# EAGLE schematic SparkFun_Artemis_Global_Tracker (EAGLE 9.6.2)

## Sheet 1 of 2
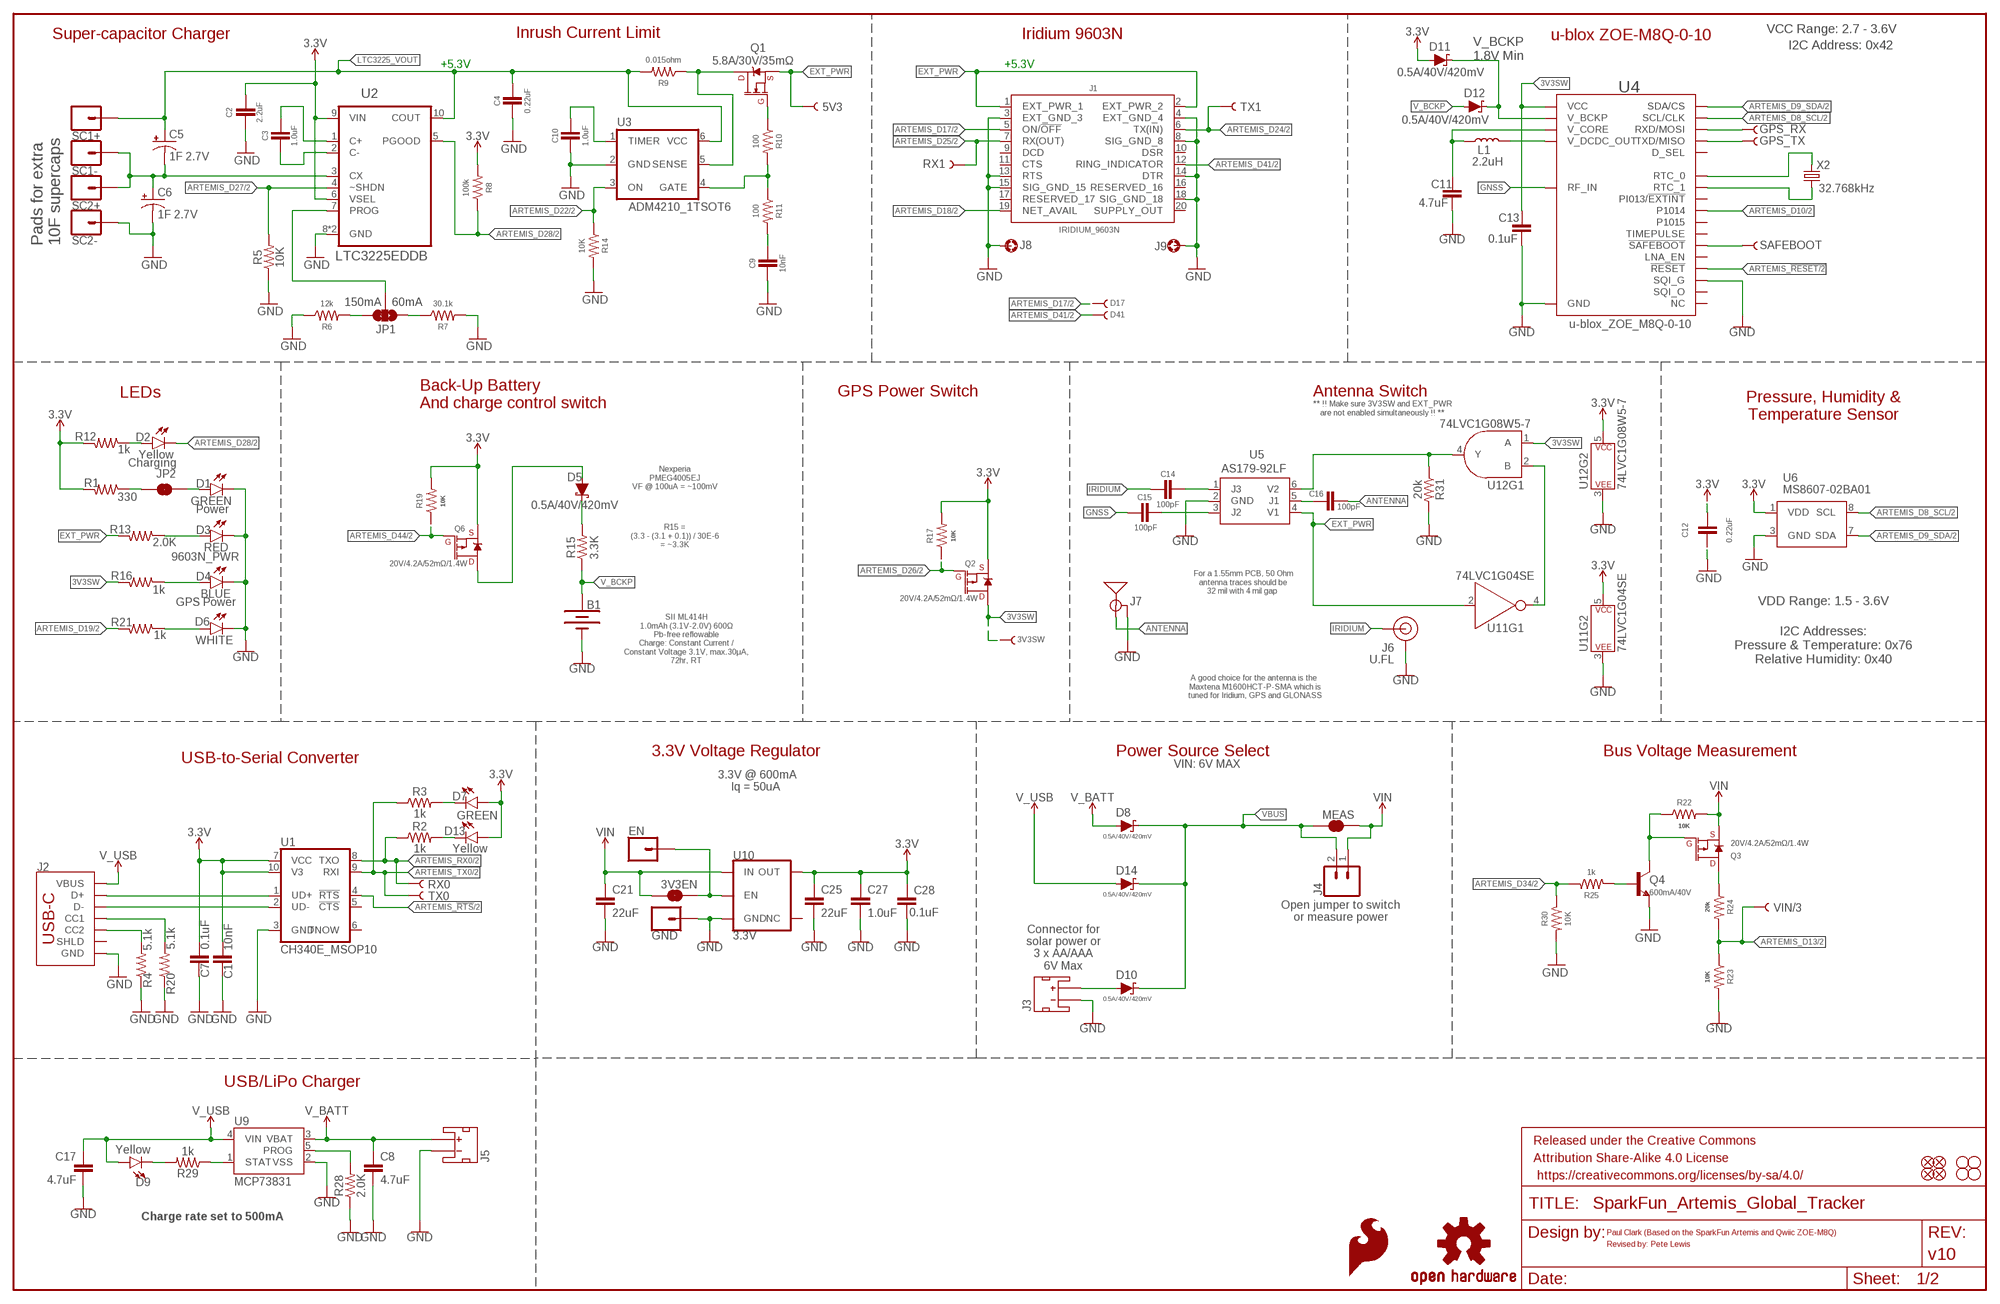
[diagram p0: schematic, sheet 1]

### Parts
3V3EN  JUMPER-SMT_2_NC_TRACE_SILK  [SMT-JUMPER_2_NC_TRACE_SILK]
3V3SW  TEST-POINT3X5  [PAD.03X.05]
5V3  TEST-POINT3X5  [PAD.03X.05]
B1  ML414H_IV01E_BATTERY  [ML414H_IV01E]
C1  10nF  10NF-0603-50V-10%  [0603]
C2  2.2uF  2.2UF-0603-10V-20%  [0603]
C3  1.0uF  1.0UF-0603-16V-10%-X7R  [0603]
C4  0.22uF  0.22UF-0603-25V-10%  [0603]
C5  1F 2.7V  1F-2.7V(PTH)CPOL-RADIAL-1H-2.7V  [CPOL-RADIAL-1F-2.7V]
C6  1F 2.7V  1F-2.7V(PTH)CPOL-RADIAL-1H-2.7V  [CPOL-RADIAL-1F-2.7V]
C7  0.1uF  0.1UF-0603-25V-5%  [0603]
C8  4.7uF  4.7UF-0603-6.3V-(10%)  [0603]
C9  10nF  10NF-0603-50V-10%  [0603]
C10  1.0uF  1.0UF-0603-16V-10%-X7R  [0603]
C11  4.7uF  4.7UF-0603-6.3V-(10%)  [0603]
C12  0.22uF  0.22UF-0603-25V-10%  [0603]
C13  0.1uF  0.1UF-0603-25V-5%  [0603]
C14  100pF  100PF-0603-50V-5%  [0603]
C15  100pF  100PF-0603-50V-5%  [0603]
C16  100pF  100PF-0603-50V-5%  [0603]
C17  4.7uF  4.7UF-0603-6.3V-(10%)  [0603]
C21  22uF  22UF-0805-16V-20%  [0805]
C25  22uF  22UF-0805-16V-20%  [0805]
C27  1.0uF  1.0UF-0603-16V-10%-X7R  [0603]
C28  0.1uF  0.1UF-0603-25V-5%  [0603]
D1  GREEN  LED-GREEN0603  [LED-0603]
D2  Yellow  LED-YELLOW0603  [LED-0603]
D3  RED  LED-RED0603  [LED-0603]
D4  BLUE  LED-BLUE0603  [LED-0603]
D5  0.5A/40V/420mV  DIODE-SCHOTTKY-PMEG4005EJ  [SOD-323]
D6  WHITE  LED-WHITE0603  [LED-0603]
D7  GREEN  LED-GREEN0603  [LED-0603]
D8  0.5A/40V/420mV  DIODE-SCHOTTKY-PMEG4005EJ  [SOD-323]
D9  Yellow  LED-YELLOW0603  [LED-0603]
D10  0.5A/40V/420mV  DIODE-SCHOTTKY-PMEG4005EJ  [SOD-323]
D11  0.5A/40V/420mV  DIODE-SCHOTTKY-PMEG4005EJ  [SOD-323]
D12  0.5A/40V/420mV  DIODE-SCHOTTKY-PMEG4005EJ  [SOD-323]
D13  Yellow  LED-YELLOW0603  [LED-0603]
D14  0.5A/40V/420mV  DIODE-SCHOTTKY-PMEG4005EJ  [SOD-323]
D17  TEST-POINT3X5  [PAD.03X.05]
D41  TEST-POINT3X5  [PAD.03X.05]
EN  CONN_01PTH_NO_SILK_YES_STOP  [1X01_NO_SILK]
FRAME5  FRAME-LEDGER  [CREATIVE_COMMONS]
GND  CONN_01PTH_NO_SILK_YES_STOP  [1X01_NO_SILK]
GPS_RX  TEST-POINT3X5  [PAD.03X.05]
GPS_TX  TEST-POINT3X5  [PAD.03X.05]
J1  IRIDIUM_9603N  [IRIDIUM_9603N]
J2  USB-C  USB_C_2-LAYER_PADS  [USB-C-16P-2LAYER-PADS]
J3  JST_2MM_MALE  [JST-2-SMD]
J4  CONN_021X02_NO_SILK  [1X02_NO_SILK]
J5  JST_2MM_MALE  [JST-2-SMD]
J6  U.FL  U.FL2PIN  [U.FL]
J7  ANTENNA-GROUNDEDEDGE_SMA  [SMA-EDGE]
J8  STAND-OFF-REFLOW-M2.0_6.0MM_TALL  [STAND-OFF-REFLOW-M2.0]
J9  STAND-OFF-REFLOW-M2.0_6.0MM_TALL  [STAND-OFF-REFLOW-M2.0]
JP1  JUMPER-SMT_3_1-NC_TRACE_SILK  [SMT-JUMPER_3_1-NC_TRACE_SILK]
JP2  JUMPER-SMT_2_NC_TRACE_SILK  [SMT-JUMPER_2_NC_TRACE_SILK]
JP7  FIDUCIAL1X2  [FIDUCIAL-1X2]
JP8  FIDUCIAL1X2  [FIDUCIAL-1X2]
JP9  STAND-OFF  [STAND-OFF]
JP10  STAND-OFF  [STAND-OFF]
JP11  STAND-OFF  [STAND-OFF]
JP12  STAND-OFF  [STAND-OFF]
JP13  FIDUCIAL1X2  [FIDUCIAL-1X2]
JP14  FIDUCIAL1X2  [FIDUCIAL-1X2]
L1  2.2uH  2.2μH_SHIELDED_INDUCTOR  [0806]
LOGO2  SFE_LOGO_FLAME.3_INCH  [SFE_LOGO_FLAME_.3]
LOGO4  OSHW-LOGOMINI  [OSHW-LOGO-MINI]
MEAS  JUMPER-SMT_2_NC_TRACE_SILK  [SMT-JUMPER_2_NC_TRACE_SILK]
Q1  5.8A/30V/35mΩ  MOSFET-NCH-AO3404A  [SOT23-3]
Q2  20V/4.2A/52mΩ/1.4W  MOSFET_PCH-DMG2305UX-7  [SOT23-3]
Q3  20V/4.2A/52mΩ/1.4W  MOSFET_PCH-DMG2305UX-7  [SOT23-3]
Q4  600mA/40V  TRANS_NPN-MMBT2222AL  [SOT23-3]
Q6  20V/4.2A/52mΩ/1.4W  MOSFET_PCH-DMG2305UX-7  [SOT23-3]
R1  330  330OHM-0402T-1/16W-5%  [0402-TIGHT]
R2  1k  1KOHM-0402T-1/16W-1%  [0402-TIGHT]
R3  1k  1KOHM-0402T-1/16W-1%  [0402-TIGHT]
R4  5.1k  5.1KOHM-0402T-1/16W-1%  [0402-TIGHT]
R5  10K  10KOHM-0402-1/10W-0.1%  [0402-TIGHT]
R6  12k  12KOHM-0603-1/10W-1%  [0603]
R7  30.1k  30.1KOHM-0603-1/10W-1%  [0603]
R8  100k  100KOHM-0603-1/10W-1%  [0603]
R9  0.015ohm  0.015OHM_1%_1/3W_0603  [0603]
R10  100  100OHM-0402-TIGHT-1/16W-1%  [0402-TIGHT]
R11  100  100OHM-0402-TIGHT-1/16W-1%  [0402-TIGHT]
R12  1k  1KOHM-0402T-1/16W-1%  [0402-TIGHT]
R13  2.0K  2.0KOHM-0402T-1/16W-1%  [0402-TIGHT]
R14  10K  10KOHM-0402-1/10W-0.1%  [0402-TIGHT]
R15  3.3K  3.3KOHM-0402T-1/16W-1%  [0402-TIGHT]
R16  1k  1KOHM-0402T-1/16W-1%  [0402-TIGHT]
R17  10K  10KOHM-0402-1/10W-0.1%  [0402-TIGHT]
R19  10K  10KOHM-0402-1/10W-0.1%  [0402-TIGHT]
R20  5.1k  5.1KOHM-0402T-1/16W-1%  [0402-TIGHT]
R21  1k  1KOHM-0402T-1/16W-1%  [0402-TIGHT]
R22  10K  10KOHM-0402-1/10W-0.1%  [0402-TIGHT]
R23  10K  10KOHM-0402-1/10W-0.1%  [0402-TIGHT]
R24  20k  20KOHM-0603-1/10W-1%  [0603]
R25  1k  1KOHM-0402T-1/16W-1%  [0402-TIGHT]
R28  2.0K  2.0KOHM-0402T-1/16W-1%  [0402-TIGHT]
R29  1k  1KOHM-0402T-1/16W-1%  [0402-TIGHT]
R30  10K  10KOHM-0402-1/10W-0.1%  [0402-TIGHT]
R31  20k  20KOHM-0402T-1/16W-1%  [0402-TIGHT]
RX0  TEST-POINT3X5  [PAD.03X.05]
RX1  TEST-POINT3X5  [PAD.03X.05]
SAFEBOOT  TEST-POINT3X5  [PAD.03X.05]
SC1+  CONN_01PTH_NO_SILK_YES_STOP  [1X01_NO_SILK]
SC1-  CONN_01PTH_NO_SILK_YES_STOP  [1X01_NO_SILK]
SC2+  CONN_01PTH_NO_SILK_YES_STOP  [1X01_NO_SILK]
SC2-  CONN_01PTH_NO_SILK_YES_STOP  [1X01_NO_SILK]
TX0  TEST-POINT3X5  [PAD.03X.05]
TX1  TEST-POINT3X5  [PAD.03X.05]
U1  CH340E_MSOP10  [MSOP10]
U2  LTC3225EDDB  LTC3225EDDBDFN300X200-10L  [DFN300X200-10L]
U3  ADM4210_1TSOT6  [TSOT6]
U4  u-blox_ZOE_M8Q-0-10  U-BLOX_ZOE_M8Q-0-10  [UBLOX_ZOE_M8-0-10]
U5  AS179-92LF  [SOT65P220X100-6N]
U6  MS8607-02BA01  [MS8607-02BA01]
U9  MCP73831  [SOT23-5]
U10  3.3V  V_REG_AP2112K-3.3V  [SOT23-5]
U11  74LVC1G04SE  [SOT353]
U12  74LVC1G08W5-7  74LVC08_W5-7  [SOT23-5]
VIN/3  TEST-POINT3X5  [PAD.03X.05]
X2  32.768kHz  CRYSTAL-32.768KHZSMD-3.2X1.5  [CRYSTAL-SMD-3.2X1.5MM]

### Nets
3.3V [3.3V]: C1.1 C2.1 C7.1 C12.1 C25.1 C27.1 C28.1 D7.A D11.A D13.A Q2.2(S) Q6.2(S) R1.2 R8.2 R12.2 R17.2 R19.2 U1.7(VCC) U1.10(V3) U2.6(VSEL) U2.9(VIN) U6.1(VDD) U10.5(OUT) U11.5(P$V+) U12.5(P$V+) ; also sheet 2
3V3SW: 3V3SW.1 C13.1 Q2.3(D) R16.2 U4.24(VCC) U4.25(VCC) U12.1(A)
ANTENNA: C16.1 J7.SIG(SIGNAL)
ARTEMIS_!RESET: U4.20(!RESET) ; also sheet 2
ARTEMIS_!RTS!: U1.4(!RTS) ; also sheet 2
ARTEMIS_D8_SCL: U4.32(SCL/CLK) U6.8(SCL) ; also sheet 2
ARTEMIS_D9_SDA: U4.2(SDA/CS) U6.7(SDA) ; also sheet 2
ARTEMIS_D10: U4.50(P1014) ; also sheet 2
ARTEMIS_D13: R23.1 R24.2 VIN/3.1 ; also sheet 2
ARTEMIS_D17: D17.1 J1.5(ON/!OFF!) ; also sheet 2
ARTEMIS_D18: J1.19(NET_AVAIL) ; also sheet 2
ARTEMIS_D19: R21.2 ; also sheet 2
ARTEMIS_D22: R14.1 U3.3(ON) ; also sheet 2
ARTEMIS_D24: J1.6(TX(IN)) TX1.1 ; also sheet 2
ARTEMIS_D25: J1.7(RX(OUT)) RX1.1 ; also sheet 2
ARTEMIS_D26: Q2.1(G) R17.1 ; also sheet 2
ARTEMIS_D27: R5.2 U2.4(~SHDN) ; also sheet 2
ARTEMIS_D28: D2.C R8.1 U2.5(PGOOD) ; also sheet 2
ARTEMIS_D34: R25.1 R30.1 ; also sheet 2
ARTEMIS_D41: D41.1 J1.12(RING_INDICATOR) ; also sheet 2
ARTEMIS_D44: Q6.1(G) R19.1 ; also sheet 2
ARTEMIS_RX0: R2.1 RX0.1 U1.8(TXO) ; also sheet 2
ARTEMIS_TX0: R3.1 TX0.1 U1.9(RXI) ; also sheet 2
CC3: J2.B5(CC2) R4.2
CC4: J2.A5(CC1) R20.2
D+2: J2.A6(D+) J2.B6(D+) U1.1(UD+)
D-2: J2.A7(D-) J2.B7(D-) U1.2(UD-)
EXT_PWR: 5V3.1 J1.1(EXT_PWR_1) J1.2(EXT_PWR_2) Q1.2(S) R13.2 U5.4(V1) U11.2(A)
GND: B1.- C1.2 C2.2 C4.2 C6.- C7.2 C8.2 C9.2 C10.2 C11.2 C12.2 C13.2 C17.2 C21.2 C25.2 C27.2 C28.2 D1.C D3.C D4.C D6.C GND.1 J1.3(EXT_GND_3) J1.4(EXT_GND_4) J1.8(SIG_GND_8) J1.13(RTS) J1.14(DTR) J1.15(SIG_GND_15) J1.18(SIG_GND_18) J2.GND J2.GND2(GND) J3.1(-) J5.1(-) J6.1(GND) J6.2(GND) J7.GND@0(GND) J7.GND@1(GND) J7.GND@2(GND) J7.GND@3(GND) J8.1 J9.1 Q4.2(E) R4.1 R5.1 R6.1 R7.2 R14.2 R20.1 R23.2 R28.1 R30.2 R31.2 SC2-.1 U1.3(GND) U2.8(GND) U2.11(GND) U3.2(GND) U4.1(GND) U4.3(GND) U4.5(GND) U4.7(GND) U4.8(GND) U4.9(GND) U4.10(GND) U4.11(GND) U4.12(GND) U4.17(GND) U4.23(GND) U4.29(SQI_G) U4.31(SQI_G) U4.37(GND) U4.38(GND) U4.39(GND) U4.40(GND) U4.41(GND) U4.44(GND) U4.46(SQI_G) U4.47(SQI_G) U4.49(GND) U5.2(GND) U6.3(GND) U9.2(VSS) U10.2(GND) U11.3(P$V-) U12.3(P$V-) ; also sheet 2
GNSS: C15.2 U4.4(RF_IN)
IRIDIUM: C14.2 J6.FEED(SIGNAL)
LTC3225_VOUT: C4.1 C5.+ R9.2 SC1+.1 U2.10(COUT) U3.6(VCC)
N$1: C5.- C6.+ SC1-.1 SC2+.1 U2.3(CX)
N$2: JP1.3 R6.2
N$3: JP2.2 R1.1
N$4: JP1.1 R7.1
N$5: D2.A R12.1
N$6: D3.A R13.1
N$7: D5.A Q6.3(D)
N$8: Q1.3(D) R9.1 U3.5(SENSE)
N$9: C3.2 U2.2(C-)
N$10: C3.1 U2.1(C+)
N$11: JP1.2 U2.7(PROG)
N$12: Q1.1(G) R10.1
N$13: R10.2 R11.1 U3.4(GATE)
N$14: C9.1 R11.2
N$15: C10.1 U3.1(TIMER)
N$16: L1.2 U4.26(V_DCDC_OUT)
N$17: C11.1 L1.1 U4.27(V_CORE)
N$18: U4.18(RTC_0) X2.P$2
N$19: U4.19(RTC_1) X2.P$1
N$20: D5.C R15.2
N$21: D4.A R16.1
N$22: D13.C R2.2
N$23: D1.A JP2.1
N$24: D11.C D12.C U4.16(V_BCKP)
N$25: SAFEBOOT.1 U4.34(!SAFEBOOT)
N$26: GPS_RX.1 U4.22(RXD/MOSI)
N$27: GPS_TX.1 U4.21(TXD/MISO)
N$28: C14.1 U5.1(J3)
N$29: C15.1 U5.3(J2)
N$30: C16.2 U5.5(J1)
N$31: R31.1 U5.6(V2) U12.4(Y)
N$32: D7.C R3.2
N$33: U11.4(Y) U12.2(B)
N$35: D6.A R21.1
N$36: 3V3EN.2 EN.1 U10.3(EN)
N$37: Q3.1(G) Q4.3(C) R22.1
N$39: R28.2 U9.5(PROG)
N$40: D9.C R29.2
N$41: R29.1 U9.1(STAT)
N$46: Q3.3(D) R24.1
N$47: Q4.1(B) R25.2
V_AAA: D10.A J3.2(+)
V_BATT: C8.1 D8.A J5.2(+) U9.3(VBAT)
V_BCKP: B1.+ D12.A R15.1
V_USB: C17.1 D9.A D14.A J2.VBUS1(VBUS) J2.VBUS2(VBUS) U9.4(VIN)
VBUS: D8.C D10.C D14.C J4.2 MEAS.1
VIN: 3V3EN.1 C21.1 J4.1 MEAS.2 Q3.2(S) R22.2 U10.1(IN)
Unconnected: J1.9(DCD) J1.10(DSR) J1.11(CTS) J1.16(RESERVED_16) J1.17(RESERVED_17) J1.20(SUPPLY_OUT) J2.SHLD1(SHLD) J2.SHLD2(SHLD) J2.SHLD3(SHLD) J2.SHLD4(SHLD) J3.NC1(PAD1) J3.NC2(PAD2) J5.NC1(PAD1) J5.NC2(PAD2) U1.5(!CTS) U1.6(TNOW) U4.6(NC) U4.13(NC) U4.14(NC) U4.15(NC) U4.28(NC) U4.30(SQI_O) U4.33(TIMEPULSE) U4.35(LNA_EN) U4.36(P1015) U4.42(NC) U4.43(PI013/!EXTINT) U4.45(SQI_O) U4.48(D_SEL) U4.51(NC) U10.4(NC)

### Notes on the sheet
- VCC Range: 2.7 - 3.6V
- Super-capacitor Charger | Inrush Current Limit | Iridium 9603N | u-blox ZOE-M8Q-0-10
- I2C Address: 0x42
- V_BCKP
  1.8V Min
- +5.3V | +5.3V
- Pads for extra
  10F supercaps
- 150mA | 60mA
- LEDs | GPS Power Switch | Antenna Switch
- Back-Up Battery
  And charge control switch
- ** !! Make sure 3V3SW and EXT_PWR
  are not enabled simultaneously !! **
- Pressure, Humidity &
  Temperature Sensor
- Charging
- Nexperia
  PMEG4005EJ
  VF @ 100uA = ~100mV
- Power
- R15 =
  (3.3 - (3.1 + 0.1)) / 30E-6
  = ~3.3K
- 9603N_PWR
- For a 1.55mm PCB, 50 Ohm
  antenna traces should be
  32 mil with 4 mil gap
- GPS Power | VDD Range: 1.5 - 3.6V
- SII ML414H
  1.0mAh (3.1V-2.0V) 600Ω
  Pb-free reflowable
  Charge: Constant Current /
  Constant Voltage 3.1V, max.30μA,
  72hr, RT
- I2C Addresses:
  Pressure & Temperature: 0x76
  Relative Humidity: 0x40
- A good choice for the antenna is the 
  Maxtena M1600HCT-P-SMA which is
  tuned for Iridium, GPS and GLONASS
- USB-to-Serial Converter | 3.3V Voltage Regulator | Power Source Select | Bus Voltage Measurement
- VIN: 6V MAX
- 3.3V @ 600mA
  Iq = 50uA
- Open jumper to switch
  or measure power
- Connector for
  solar power or
  3 x AA/AAA
  6V Max
- USB/LiPo Charger
- Charge rate set to 500mA
- Paul Clark (Based on the SparkFun Artemis and Qwiic ZOE-M8Q)
- Revised by: Pete Lewis

## Sheet 2 of 2
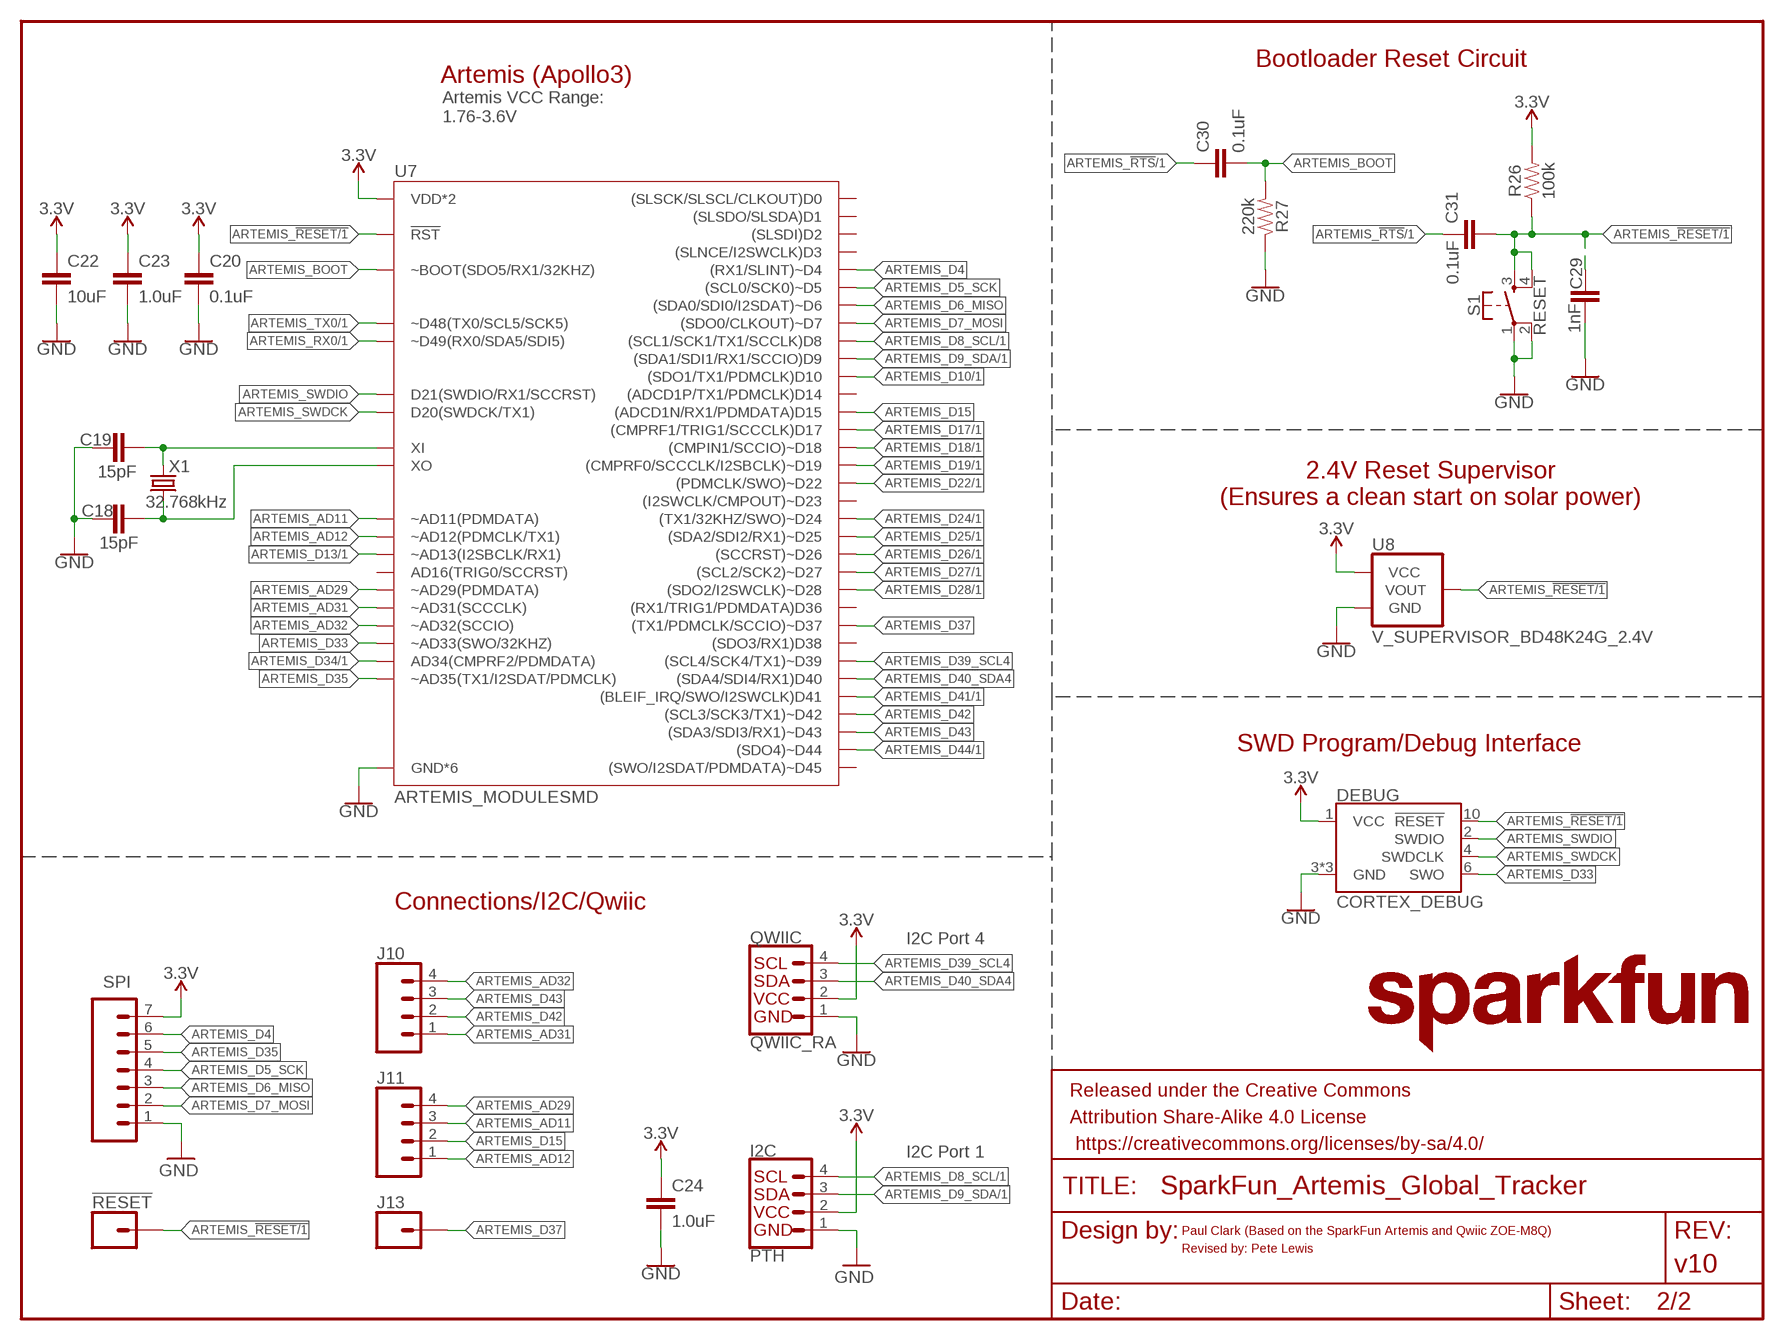
[diagram p1: schematic, sheet 2]

### Parts
!RESET  CONN_01PTH_NO_SILK_YES_STOP  [1X01_NO_SILK]
C18  15pF  15PF-0603-50V-5%  [0603]
C19  15pF  15PF-0603-50V-5%  [0603]
C20  0.1uF  0.1UF-0603-25V-5%  [0603]
C22  10uF  10UF-0603-6.3V-20%  [0603]
C23  1.0uF  1.0UF-0603-16V-10%-X7R  [0603]
C24  1.0uF  1.0UF-0603-16V-10%-X7R  [0603]
C29  1nF  1.0NF/1000PF-0603-50V-10%  [0603]
C30  0.1uF  0.1UF-0603-25V-5%  [0603]
C31  0.1uF  0.1UF-0603-25V-5%  [0603]
DEBUG  CORTEX_DEBUG  CORTEX_JTAG_DEBUG_MINIMUM_PTH_NS  [2X5-PTH-1.27MM-NO_SILK]
FRAME3  FRAME-LETTERNO_PACKAGE  [DUMMY]
I2C  PTH  I2C_STANDARD_NO_SILK  [1X04_NO_SILK]
J10  CONN_041X04_NO_SILK_NO_POP  [1X04_NO_SILK]
J11  CONN_041X04_NO_SILK_NO_POP  [1X04_NO_SILK]
J13  CONN_01PTH_NO_SILK_YES_STOP  [1X01_NO_SILK]
LOGO1  SFE_LOGO_NAME.1_INCH  [SFE_LOGO_NAME_.1]
QWIIC  QWIIC_RA  QWIIC_CONNECTORJS-1MM  [JST04_1MM_RA]
R26  100k  100KOHM-0603-1/10W-1%  [0603]
R27  220k  220KOHM-0603-1/10W-1%  [0603]
S1  RESET  MOMENTARY-SWITCH-SPST-2-SMD-5.2MM-TALL  [TACTILE_SWITCH_SMD_5.2MM]
SPI  CONN_07NO_SILK  [1X07_NO_SILK]
U7  ARTEMIS_MODULESMD  [ARTEMIS_FP]
U8  V_SUPERVISOR_BD48K24G_2.4V  [SOT23-3]
X1  32.768kHz  CRYSTAL-32.768KHZSMD-3.2X1.5  [CRYSTAL-SMD-3.2X1.5MM]

### Nets
3.3V [3.3V]: C20.2 C22.1 C23.1 C24.1 DEBUG.1(VCC) I2C.2 QWIIC.2 R26.2 SPI.7 U7.VDD@36(VDD*2) U7.VDD@37(VDD*2) U8.3(VCC) ; also sheet 1
ARTEMIS_!RESET: !RESET.1 C29.1 C31.2 DEBUG.10(!RESET) R26.1 S1.3 S1.4 U7.~RST(!RST) U8.2(VOUT) ; also sheet 1
ARTEMIS_!RTS!: C30.1 C31.1 ; also sheet 1
ARTEMIS_AD11: J11.3 U7.~AD11(~AD11(PDMDATA))
ARTEMIS_AD12: J11.1 U7.~AD12(~AD12(PDMCLK/TX1))
ARTEMIS_AD29: J11.4 U7.~AD29(~AD29(PDMDATA))
ARTEMIS_AD31: J10.1 U7.~AD31(~AD31(SCCCLK))
ARTEMIS_AD32: J10.4 U7.~AD32(~AD32(SCCIO))
ARTEMIS_BOOT: C30.2 R27.2 U7.BOOT(~BOOT(SDO5/RX1/32KHZ))
ARTEMIS_D4: SPI.6 U7.~D4((RX1/SLINT)~D4)
ARTEMIS_D5_SCK: SPI.4 U7.~D5((SCL0/SCK0)~D5)
ARTEMIS_D6_MISO: SPI.3 U7.~D6((SDA0/SDI0/I2SDAT)~D6)
ARTEMIS_D7_MOSI: SPI.2 U7.D7((SDO0/CLKOUT)~D7)
ARTEMIS_D8_SCL: I2C.4 U7.D8((SCL1/SCK1/TX1/SCCLK)D8) ; also sheet 1
ARTEMIS_D9_SDA: I2C.3 U7.D9((SDA1/SDI1/RX1/SCCIO)D9) ; also sheet 1
ARTEMIS_D10: U7.D10((SDO1/TX1/PDMCLK)D10) ; also sheet 1
ARTEMIS_D13: U7.~AD13(~AD13(I2SBCLK/RX1)) ; also sheet 1
ARTEMIS_D15: J11.2 U7.D15((ADCD1N/RX1/PDMDATA)D15)
ARTEMIS_D17: U7.D17((CMPRF1/TRIG1/SCCCLK)D17) ; also sheet 1
ARTEMIS_D18: U7.~D18((CMPIN1/SCCIO)~D18) ; also sheet 1
ARTEMIS_D19: U7.~D19((CMPRF0/SCCCLK/I2SBCLK)~D19) ; also sheet 1
ARTEMIS_D22: U7.~D22((PDMCLK/SWO)~D22) ; also sheet 1
ARTEMIS_D24: U7.~D24((TX1/32KHZ/SWO)~D24) ; also sheet 1
ARTEMIS_D25: U7.~D25((SDA2/SDI2/RX1)~D25) ; also sheet 1
ARTEMIS_D26: U7.~D26((SCCRST)~D26) ; also sheet 1
ARTEMIS_D27: U7.~D27((SCL2/SCK2)~D27) ; also sheet 1
ARTEMIS_D28: U7.~D28((SDO2/I2SWCLK)~D28) ; also sheet 1
ARTEMIS_D33: DEBUG.6(SWO) U7.~AD33/SWO(~AD33(SWO/32KHZ))
ARTEMIS_D34: U7.AD34(AD34(CMPRF2/PDMDATA)) ; also sheet 1
ARTEMIS_D35: SPI.5 U7.~AD35(~AD35(TX1/I2SDAT/PDMCLK))
ARTEMIS_D37: J13.1 U7.~D37((TX1/PDMCLK/SCCIO)~D37)
ARTEMIS_D39_SCL4: QWIIC.4 U7.~D39((SCL4/SCK4/TX1)~D39)
ARTEMIS_D40_SDA4: QWIIC.3 U7.D40((SDA4/SDI4/RX1)D40)
ARTEMIS_D41: U7.D41((BLEIF_IRQ/SWO/I2SWCLK)D41) ; also sheet 1
ARTEMIS_D42: J10.2 U7.~D42((SCL3/SCK3/TX1)~D42)
ARTEMIS_D43: J10.3 U7.~D43((SDA3/SDI3/RX1)~D43)
ARTEMIS_D44: U7.~D44((SDO4)~D44) ; also sheet 1
ARTEMIS_RX0: U7.RXI-0(~D49(RX0/SDA5/SDI5)) ; also sheet 1
ARTEMIS_SWDCK: DEBUG.4(SWDCLK) U7.SWDCK(D20(SWDCK/TX1))
ARTEMIS_SWDIO: DEBUG.2(SWDIO) U7.SWDIO(D21(SWDIO/RX1/SCCRST))
ARTEMIS_TX0: U7.TXO-0(~D48(TX0/SCL5/SCK5)) ; also sheet 1
GND: C18.1 C19.1 C20.1 C22.2 C23.2 C24.2 C29.2 DEBUG.3(GND) DEBUG.5(GND) DEBUG.9(GND) I2C.1 QWIIC.1 R27.1 S1.1 S1.2 SPI.1 U7.GND@1(GND*6) U7.GND@22(GND*6) U7.GND@38(GND*6) U7.GND@39(GND*6) U7.GND@47(GND*6) U7.GND@59(GND*6) U8.1(GND) ; also sheet 1
XTALI: C19.2 U7.XI X1.P$1
XTALO: C18.2 U7.XO X1.P$2
Unconnected: U7.AD16(AD16(TRIG0/SCCRST)) U7.D0((SLSCK/SLSCL/CLKOUT)D0) U7.D1((SLSDO/SLSDA)D1) U7.D2((SLSDI)D2) U7.D3((SLNCE/I2SWCLK)D3) U7.D14((ADCD1P/TX1/PDMCLK)D14) U7.D36((RX1/TRIG1/PDMDATA)D36) U7.D38((SDO3/RX1)D38) U7.~D23((I2SWCLK/CMPOUT)~D23) U7.~D45((SWO/I2SDAT/PDMDATA)~D45)

### Notes on the sheet
- Bootloader Reset Circuit
- Artemis (Apollo3)
- Artemis VCC Range:
  1.76-3.6V
- 2.4V Reset Supervisor
  (Ensures a clean start on solar power)
- SWD Program/Debug Interface
- Connections/I2C/Qwiic
- I2C Port 4
- I2C Port 1
- Paul Clark (Based on the SparkFun Artemis and Qwiic ZOE-M8Q)
- Revised by: Pete Lewis

## Library data of the parts
3V3EN JP2 MEAS = SparkFun-Jumpers:JUMPER-SMT_2_NC_TRACE: Normally closed trace jumper This jumper has a trace between two pads so it's normally closed (NC). Use a razor knife to open the connection. For best results follow the IPC guidelines for cutting traces: Cutout at least 0.063 mm (0.005 in). Remove all loose material to clean up the cut area. Seal the cut with an approved epoxy. Reapply solder to reclose the connection.
3V3SW 5V3 D17 D41 GPS_RX GPS_TX RX0 RX1 SAFEBOOT TX0 TX1 VIN/3 = SparkFun-Connectors:TEST-POINT: SparkFun Test Points Bare copper test points for troubleshooting or In-Circuit-Testing. These are used by our Production team for verifying production board runs using pogo-pins on test beds. SparkFun Products: SparkFun LSM9DS1 Breakout <https://www.sparkfun.com/products/13284> SparkFun PSOC <https://www.sparkfun.com/products/13714> SparkFun Load Cell Amplifier <https://www.sparkfun.com/products/13879>
!RESET EN GND J13 SC1+ SC1- SC2+ SC2- = SparkFun-Connectors:CONN_01: Single connection point. Often used as Generic Header-pin footprint for 0.1 inch spaced/style header connections On any of the 0.1 inch spaced packages, you can populate with these: Break Away Headers - Straight <https://www.sparkfun.com/products/116> (PRT-00116) Break Away Male Headers - Right Angle <https://www.sparkfun.com/products/553> (PRT-00553) Female Headers <https://www.sparkfun.com/products/115> (PRT-00115) Break Away Headers - Machine Pin <https://www.sparkfun.com/products/117> (PRT-00117) Break Away Female Headers - Swiss Machine Pin <https://www.sparkfun.com/products/743> (PRT-00743) This device is also useful as a general connection point to wire up your design to another part of your project. Our various solder wires solder well into these plated through hole pads. Hook-Up Wire - Assortment (Stranded, 22 AWG) <https://www.sparkfun.com/products/11375> (PRT-11375) Hook-Up Wire - Assortment (Solid Core, 22 AWG) <https://www.sparkfun.com/products/11367> (PRT-11367) View the entire wire category on our website here <https://www.sparkfun.com/categories/141> Special notes: SMTSO-256-ET is a "flush mount" nut for a 4-40 screw. We mostly use this on specialty testbeds; it is a nice way to connect hardware to your PCB at an adjustable hieght. Also note, the SNAP packages are for using a snappable style connector. We sell a baggie of snaps and they are also used on two LilyPad designs: Snap Assortment - 30 pack (male and female) <https://www.sparkfun.com/products/11347> (DEV-11347) LilyPad Arduino SimpleSnap <https://www.sparkfun.com/products/10941> (DEV-10941) LilyPad SimpleSnap Protoboard <https://www.sparkfun.com/products/10940> (DEV-10940)
B1 = SparkFun-Batteries:ML414H_IV01E_BATTERY: SEIKO ML414H-IV01E Reflowable Lithium Battery ML414H is a rechargeable, coin type battery with features such as Pb-free reflowable (Peak temperature: 260 C) and high temperature heat resistance. Battery Characteristics: 3.1V max voltage Voff is 2V 1mAH 3k series resistor with battery 72 hour charge time from 2.0-3.1V 2.3-2.8V initial charge; PROD_ID: BATT-14267
C1 C9 = SparkFun-Capacitors:10NF: 0.01uF/10nF/10,000pF ceramic capacitors A capacitor is a passive two-terminal electrical component used to store electrical energy temporarily in an electric field. CAP-09321; PROD_ID: CAP-00867
C2 = SparkFun-Capacitors:2.2UF: 2.2µF ceramic capacitors A capacitor is a passive two-terminal electrical component used to store electrical energy temporarily in an electric field.; PROD_ID: CAP-07888
C3 C10 C23 C24 C27 = SparkFun-Capacitors:1.0UF: 1µF ceramic capacitors A capacitor is a passive two-terminal electrical component used to store electrical energy temporarily in an electric field.; PROD_ID: CAP-13930
C4 C12 = SparkFun-Capacitors:0.22UF: 0.22µF ceramic capacitors A capacitor is a passive two-terminal electrical component used to store electrical energy temporarily in an electric field.; PROD_ID: CAP-07822
C5 C6 = SparkFun-Capacitors:1F-2.7V(PTH): 1F 2.7V SuperCapacitor CAP-14696; PROD_ID: CAP-14696
C7 C13 C20 C28 C30 C31 = SparkFun-Capacitors:0.1UF: 0.1µF ceramic capacitors A capacitor is a passive two-terminal electrical component used to store electrical energy temporarily in an electric field.; PROD_ID: CAP-08604
C8 C11 C17 = SparkFun-Capacitors:4.7UF: 4.7µF ceramic capacitors A capacitor is a passive two-terminal electrical component used to store electrical energy temporarily in an electric field.; PROD_ID: CAP-08280
C14-C16 = SparkFun-Capacitors:100PF: 100pF/0.1nF ceramic capacitors A capacitor is a passive two-terminal electrical component used to store electrical energy temporarily in an electric field.; PROD_ID: CAP-07883
C18 C19 = SparkFun-Capacitors:15PF: 15pF ceramic capacitors A capacitor is a passive two-terminal electrical component used to store electrical energy temporarily in an electric field.; PROD_ID: CAP-07881
C21 C25 = SparkFun-Capacitors:22UF: 22µF ceramic capacitors A capacitor is a passive two-terminal electrical component used to store electrical energy temporarily in an electric field.; PROD_ID: CAP-14260
C22 = SparkFun-Capacitors:10UF: 10.0µF ceramic capacitors A capacitor is a passive two-terminal electrical component used to store electrical energy temporarily in an electric field.; PROD_ID: CAP-11015
C29 = SparkFun-Capacitors:1.0NF/1000PF: 1nF/1,000pF ceramic capacitors A capacitor is a passive two-terminal electrical component used to store electrical energy temporarily in an electric field.; PROD_ID: CAP-07886
D1 D7 = SparkFun-LED:LED-GREEN: Green SMD LED Used in manufacturing of various products at SparkFun Packages: 0603 - SMD 0603 package [Product Link] <http://www.futureelectronics.com/en/technologies/semiconductors/optoelectronics/leds/Pages/9894312-LTST-C190GKT.aspx?CrossPart=HSMG-C190&IM=0> LilyPad 1206 - SMD1206 LilyPad package [Product Link] <http://www.futureelectronics.com/en/Technologies/Product.aspx?ProductID=IN150NGHARVATEKCORPORATION2049943&IM=0> 1206 - SMD1206 package [Product Link] <http://www.futureelectronics.com/en/technologies/semiconductors/optoelectronics/leds/Pages/8315665-LTST-C150KGKT.aspx?IM=0> 1206 Bottom Mount -SMD 1206 Bottom Mount [Product Link] <http://www.digikey.com/product-detail/en/lite-on-inc/LTST-C230KGKT/160-1456-1-ND/386854> SparkFun Products: Pro Mini 328 -5V <https://www.sparkfun.com/products/821> RedBoard <https://www.sparkfun.com/products/12757> MP3 Trigger <https://www.sparkfun.com/products/13720> Makey Makey <https://www.sparkfun.com/products/11076>; PROD_ID: DIO-00821
D2 D9 D13 = SparkFun-LED:LED-YELLOW: Yellow SMD LED Used in manufacturing several products at SparkFun. Packages: 0603 - SMD 0603 package[Product Link] <http://www.kingbrightusa.com/product.asp?catalog_name=LED&product_id=APT1608SYCK> 0603 -SMART - SMART SMD 0603 package (more efficient/more expensive) [Product Link] <http://www.osram-os.com/osram_os/en/products/product-catalog/led-light-emitting-diodes/smartled-0603/ly-l29k/index.jsp> LilyPad - SMD1206 package[Product Datasheet] <https://www.sparkfun.com/datasheets/DevTools/LilyPad/Q150YUS4.pdf> SparkFun Products: Blynk Board <https://www.sparkfun.com/products/13794> IOIO-OTG <https://www.sparkfun.com/products/13613> XBee Explorer Serial <https://www.sparkfun.com/products/13225>; PROD_ID: DIO-09003
D3 = SparkFun-LED:LED-RED: Red SMD LED Used in manufacturing of most products at SparkFun Packages: 0603 - SMD 0603 package [Product Link] <http://docs.avagotech.com/docs/AV02-0551EN> 0603 SMART - SMD 0603 SMART package ( more efficient and expensive)[Product Link] <http://www.osram-os.com/Graphics/XPic2/00077099_0.pdf> 1206 - SMD1206 package [Product Link] <https://www.sparkfun.com/datasheets/DevTools/LilyPad/Q150OVS4.pdff> SparkFun Products: Pro Mini 328 -5V <https://www.sparkfun.com/products/821> RedBoard <https://www.sparkfun.com/products/12757> IOIO-OTG <https://www.sparkfun.com/products/13613>; PROD_ID: DIO-00819
D4 = SparkFun-LED:LED-BLUE: Blue SMD LED Used in manufacturing of various products at SparkFun Packages: 0603 - SMD 0603 package [Product Link] <http://www.digikey.com/product-detail/en/SMLE12BC7TT86/511-1589-2-ND/1641808> 1206 - SMD1206 package [Product Link] <http://www.digikey.com/product-detail/en/lite-on-inc/LTST-C150TBKT/160-1643-1-ND/573584> SparkFun Products: ESP8266 Thing-Dev Board <https://www.sparkfun.com/products/13711> RedBoard <https://www.sparkfun.com/products/12757>; PROD_ID: DIO-08575
D5 D8 D10-D12 D14 = SparkFun-DiscreteSemi:DIODE-SCHOTTKY: Schottky diode A Schottky diode is a semiconductor diode which has a low forward voltage drop and a very fast switching action.; PROD_ID: DIO-10955
D6 = SparkFun-LED:LED-WHITE: White SMD LED Used in manufacturing several products at SparkFun. Packages: 0603 - Bright White SMD 0603 package[Product Link] <http://www.kingbrightusa.com/product.asp?catalog_name=LED&product_id=APT1608QWF/D> 1206 - Bright White SMD1206 package [Product Link] <http://www.kingbrightusa.com/product.asp?catalog_name=LED&product_id=APT3216QWF/D> 3014 - Super Bright SMD 3014 package [Datasheet] <http://www.lumileds.com/uploads/459/DS208-pdf> SparkFun Products: Blackberry Trackballer Breakout <https://www.sparkfun.com/products/13169> Digital SandBox <https://www.sparkfun.com/products/12651>; PROD_ID: DIO-09004
DEBUG = SparkFun-Connectors:CORTEX_JTAG_DEBUG_MINIMUM: Cortex Debug Connector - 10 pin Supports JTAG debug, Serial Wire debug, and Serial Wire Viewer. PTH and SMD connector options available. General Connector Information <http://infocenter.arm.com/help/topic/com.arm.doc.faqs/attached/13634/cortex_debug_connectors.pdf> Products: PTH Connector <http://www.digikey.com/product-detail/en/cnc-tech/3220-10-0100-00/1175-1627-ND/3883661> -via Digi-Key SparkFun PSoc <https://www.sparkfun.com/products/13229> SparkFun T <https://www.sparkfun.com/products/13810>
FRAME3 = SparkFun-Aesthetics:FRAME-LETTER: Schematic Frame - Letter Standard 8.5x11 US Letter frame; DESIGNER: Nobody; REV: v10; VERSION: v10
FRAME5 = SparkFun-Aesthetics:FRAME-LEDGER: Schematic Frame - Ledger Standard 11x14 US Ledger frame; REV: v10
I2C = SparkFun-Connectors:I2C_STANDARD: SparkFun I2C Standard Pinout Header SparkFun has standardized on a pinout for all I2C based sensor breakouts. This pinout allows I2C boards to be plugged directly into the headers on Arduino Uno compatible boards, and to be daisy chained easily. Example SparkFun Products: SparkFun Atmospheric Sensor Breakout - BME280 <https://www.sparkfun.com/products/13676> SparkFun Altitude/Pressure Sensor Breakout - MPL3115A2 <https://www.sparkfun.com/products/11084> SparkFun TOF Range Finder Sensor - VL6180 <https://www.sparkfun.com/products/12785>
J1 = SparkFun-RF:IRIDIUM_9603N: Iridium 9603N Modem Connector is Samtec SS4-10-3.50-L-D-K-TR Requires two HW-14879 M2x0.4 6mm-tall reflow standoffs. The position of the standoffs is shown on the footprint tDocu.; PROD_ID: CONN-14689
J2 = SparkFun-Connectors:USB_C: USB Type C 16Pin Connector Super Speed pins not available on the 16-pin purely SMD connector so this part is best for USB 2.0 implementations. D1 and D2 are tied together enabling D+/- no matter which way the cable is plugged into the connector. The two channel configuration pins (CC1/2) are exposed. These are normally connected to ground via 5.1k resistors but can be reconfigured for high current/high power applications. **4-LAYER BOARD WARNING!!** If designing 4-layer board, make sure to select the variant _4-LAYER-ISOLATED. The linked footprint (USB-C-16-4LAYER-ISOLATED) includes some very necessary cutout polygons in the inner layers (2 and 15). This prevents the PTH mounting shield legs on the USB connector from electrically connecting any other polygons on the inner layers (usually VCC and GND).; PROD_ID: CONN-14122
J3 J5 = SparkFun-Connectors:JST_2MM_MALE: JST 2MM MALE RA CONNECTOR Two pin, compact surface mount connector. Commonly used as a battery input connection point. We really like the solid locking feeling and high current rating on these small connectors. We use these all the time as battery connectors. Mates to single-cell LiPo batteries. Here is the connector we sell at SparkFun: JST Right Angle Connector - White <https://www.sparkfun.com/products/8612> (PRT-08612) Datasheet <http://www.sparkfun.com/datasheets/Prototyping/Connectors/JST-Horizontal.pdf> It was used on these SparkFun products: SparkFun MOSFET Power Controller <https://www.sparkfun.com/products/11214> (PRT-11214) SparkFun Battery Babysitter - LiPo Battery Manager <https://www.sparkfun.com/products/13777> (PRT-13777) And many, many others that required a lipo battery connection.; PROD_ID: CONN-11443; SF_ID: PRT-08612
J4 = SparkFun-Connectors:CONN_02: Multi connection point. Often used as Generic Header-pin footprint for 0.1 inch spaced/style header connections On any of the 0.1 inch spaced packages, you can populate with these: Break Away Headers - Straight <https://www.sparkfun.com/products/116> (PRT-00116) Break Away Male Headers - Right Angle <https://www.sparkfun.com/products/553> (PRT-00553) Female Headers <https://www.sparkfun.com/products/115> (PRT-00115) Break Away Headers - Machine Pin <https://www.sparkfun.com/products/117> (PRT-00117) Break Away Female Headers - Swiss Machine Pin <https://www.sparkfun.com/products/743> (PRT-00743) For SCREWTERMINALS and SPRING TERMINALS visit here: Screw Terimnals on SparkFun.com <https://www.sparkfun.com/search/results?term=Screw+Terminals> (5mm/3.5mm/2.54mm spacing) This device is also useful as a general connection point to wire up your design to another part of your project. Our various solder wires solder well into these plated through hole pads. Hook-Up Wire - Assortment (Stranded, 22 AWG) <https://www.sparkfun.com/products/11375> (PRT-11375) Hook-Up Wire - Assortment (Solid Core, 22 AWG) <https://www.sparkfun.com/products/11367> (PRT-11367) View the entire wire category on our website here <https://www.sparkfun.com/categories/141> Special notes: Molex polarized connector foot print use with: PRT-08233 with associated crimp pins and housings. 2.54_SCREWTERM for use with PRT-10571. 3.5mm Screw Terminal footprints for PRT-08084 5mm Screw Terminal footprints for use with PRT-08432
J6 = SparkFun-Connectors:U.FL2PIN: SMD Antenna Connector - U.FL 2mm height, 3.0mm x 3.0mm receptacle size. SparkFun Products: SparkFun WiFi Shield - ESP8266 <https://www.sparkfun.com/products/13287> SparkFun ESP8266 Thing <https://www.sparkfun.com/products/13231> SparkFun MiniGen - Pro Mini Signal Generator Shield <https://www.sparkfun.com/products/11420>; PROD_ID: CONN-09193; SF_ID: WRL-09144
J7 = SparkFun-RF:ANTENNA-GROUNDED: Antenna w/ Ground Connection 2.4GHz antennae with signal and ground terminals. TRACE_ANTENNA_2.4GHZ_15.2MM - Meander Trace antenna 15.2 x 5.7mm footprint Based on layout from TI app note AN043 <http://www.ti.com/lit/an/swra117d/swra117d.pdf>. TRACE_ANTENNA_2.4GHZ_25.7MM - Inverted F trace antenna 25.7 x 7.5 mm footprint. Based on layout from TI design note DN0007 <http://www.ti.com/lit/an/swru120b/swru120b.pdf>.; PROD_ID: CONN-08289
J8 J9 = SparkFun-Hardware:STAND-OFF-REFLOW: Stand Off Reflow Compatible A metal standoff that can be placed and reflowed onto a PCB. The M2.5 x 2.5mm variant is used on MicroMod. The M2.0 x 6.0mm variant is used to mount the Iridium 9603N modem.; PROD_ID: HW-14879
J10 J11 = SparkFun-Connectors:CONN_04: Multi connection point. Often used as Generic Header-pin footprint for 0.1 inch spaced/style header connections On any of the 0.1 inch spaced packages, you can populate with these: Break Away Headers - Straight <https://www.sparkfun.com/products/116> (PRT-00116) Break Away Male Headers - Right Angle <https://www.sparkfun.com/products/553> (PRT-00553) Female Headers <https://www.sparkfun.com/products/115> (PRT-00115) Break Away Headers - Machine Pin <https://www.sparkfun.com/products/117> (PRT-00117) Break Away Female Headers - Swiss Machine Pin <https://www.sparkfun.com/products/743> (PRT-00743) For SCREWTERMINALS and SPRING TERMINALS visit here: Screw Terimnals on SparkFun.com <https://www.sparkfun.com/search/results?term=Screw+Terminals> (5mm/3.5mm/2.54mm spacing) This device is also useful as a general connection point to wire up your design to another part of your project. Our various solder wires solder well into these plated through hole pads. Hook-Up Wire - Assortment (Stranded, 22 AWG) <https://www.sparkfun.com/products/11375> (PRT-11375) Hook-Up Wire - Assortment (Solid Core, 22 AWG) <https://www.sparkfun.com/products/11367> (PRT-11367) View the entire wire category on our website here <https://www.sparkfun.com/categories/141> Special notes: Molex polarized connector foot print use with SKU : PRT-08231 with associated crimp pins and housings. 1MM SMD Version SKU: PRT-10208
JP1 = SparkFun-Jumpers:JUMPER-SMT_3_1-NC_TRACE: Normally closed trace jumper (1 of 2 connections) This jumper has a trace between two pads so it's normally closed (NC). The other connection is normally open (NO). Use a razor knife to open the connection. For best results follow the IPC guidelines for cutting traces: Cutout at least 0.063 mm (0.005 in). Remove all loose material to clean up the cut area. Seal the cut with an approved epoxy. Reapply solder to reclose the connection, or to close the NO connection.
JP7 JP8 JP13 JP14 = SparkFun-Aesthetics:FIDUCIAL: Fiducial Alignment Points Point-of-reference for pick-and-place machines and other optical instruments.
JP9-JP12 = SparkFun-Hardware:STAND-OFF: Stand Off Drill holes for mechanically mounting via screws, standoffs, etc. Note: Use the keepout ring to avoid running the screw head into surrounding components. Variant Overviews STAND-OFF - Mechanical footprint for a #4 phillips button head screw. STAND-OFF-TIGHT - Mechanical footprint for a #4 phillips button head screw, Example SparkFun Products Screw - Phillips Head (1/4", 4-40, 10 pack) <https://www.sparkfun.com/products/10453> (PRT-10453) Screw - Phillips Head (1/2", 4-40, 10 pack) <https://www.sparkfun.com/products/10452> (PRT-10452) Screw - Phillips Head (3/4", 4-40, 10 pack) <https://www.sparkfun.com/products/10451> (PRT-10451) Screw - Phillips Head (1", 4-40, 10 pack) <https://www.sparkfun.com/products/10450> (PRT-10450)
L1 = SparkFun-Coils:2.2μH_SHIELDED_INDUCTOR: Murata 2.2uH Inductor 2.2uH 1.2A 110mOhm 0806 Package Shielded Bourns 2.2uH Inductor 2.2uH 5.5A 205mOhm 5x5mm Package Shielded; PROD_ID: NDUC-14257
LOGO1 = SparkFun-Aesthetics:SFE_LOGO_NAME: SparkFun Font Logo This is the SparkFun name logo. The logo on the schematic will always be the same size; the package variant is the height of the flame part of the logo (or the height the flame would be, if it were drawn). Default layer for the logo on the board is tSilk.
LOGO2 = SparkFun-Aesthetics:SFE_LOGO_FLAME: SparkFun Flame Logo This is the SparkFun flame logo. The logo on the schematic will always be the same size; the package variant is the height of the flame. Default layer for the logo on the board is tSilk.
LOGO4 = SparkFun-Aesthetics:OSHW-LOGO: Open-Source Hardware (OSHW) Logo This logo indicates the piece of hardware it is found on incorporates a OSHW license and/or adheres to the definition of open source hardware found here: http://freedomdefined.org/OSHW
Q1 = SparkFun-DiscreteSemi:MOSFET-NCH: N-channel MOSFETs Voltage controlled devices that allow control of high current outputs. SparkFun Products: SparkFun OpenScale <https://www.sparkfun.com/products/13261> SparkFun Digital Sandbox <https://www.sparkfun.com/products/12651> SparkFun Monster Moto Shield <https://www.sparkfun.com/products/10182> SparkFun MOSFET Power Controller <https://www.sparkfun.com/products/11214>; PROD_ID: TRANS-12988
Q2 Q3 Q6 = SparkFun-DiscreteSemi:MOSFET_PCH: P-channel MOSFETs Voltage controlled devices that allow control of high current outputs. SparkFun Products: SparkFun ESP32 Thing <https://www.sparkfun.com/products/13907> SparkFun ESP8266 Thing <https://www.sparkfun.com/products/13231> SparkFun Pi Servo HAT V2 <https://www.sparkfun.com/products/15316> DMG2305UX-7 (20V/4.2A/SOT23-3); PROD_ID: TRANS-14388
Q4 = SparkFun-DiscreteSemi:TRANS_NPN: NPN transistor Current controlled devices typically used to amplify current or used as a switch. BC547 - COM-08928 <http://www.sparkfun.com/products/8928> (TO-92 45V 100mA) (1.Collector 2.Base 3.Emitter) 2N3904 - COM-00521 <http://www.sparkfun.com/products/521> (TO-92 40V 200mA) (1.Emitter 2.Base 3.Collector) P2N2222A - COM-12852 <http://www.sparkfun.com/products/12852> (TO-92 40V 600mA) (1.Collector 2.Base 3.Emitter); PROD_ID: TRANS-08049
QWIIC = SparkFun-Connectors:QWIIC_CONNECTOR: SparkFun I2C Standard Qwiic Connector An SMD 1mm pitch JST connector makes it easy and quick (get it? Qwiic?) to connect I2C devices to each other. The Qwiic system <http://www.sparkfun.com/qwiic> enables fast and solderless connection between popular platforms and various sensors and actuators. We carry 200mm <https://www.sparkfun.com/products/14204>, 100mm <https://www.sparkfun.com/products/14205>, 50mm <https://www.sparkfun.com/products/14206>, and breadboard friendly <https://www.sparkfun.com/products/14207> Qwiic cables. We also offer 10 pcs strips <https://www.sparkfun.com/products/14323> the SMD connectors.; PROD_ID: CONN-13694; VALUE: QWIIC_RIGHT_ANGLE
R1 = SparkFun-Resistors:330OHM: 330Ω resistor A resistor is a passive two-terminal electrical component that implements electrical resistance as a circuit element. Resistors act to reduce current flow, and, at the same time, act to lower voltage levels within circuits. - Wikipedia; PROD_ID: RES-15407
R2 R3 R12 R16 R21 R25 R29 = SparkFun-Resistors:1KOHM: 1kΩ resistor A resistor is a passive two-terminal electrical component that implements electrical resistance as a circuit element. Resistors act to reduce current flow, and, at the same time, act to lower voltage levels within circuits. - Wikipedia; PROD_ID: RES-14342
R4 R20 = SparkFun-Resistors:5.1KOHM; PROD_ID: RES-14340
R5 R14 R17 R19 R22 R23 R30 = SparkFun-Resistors:10KOHM: 10kΩ resistor A resistor is a passive two-terminal electrical component that implements electrical resistance as a circuit element. Resistors act to reduce current flow, and, at the same time, act to lower voltage levels within circuits. - Wikipedia; PROD_ID: RES-16147
R6 = SparkFun-Resistors:12KOHM: 12kΩ resistor A resistor is a passive two-terminal electrical component that implements electrical resistance as a circuit element. Resistors act to reduce current flow, and, at the same time, act to lower voltage levels within circuits. - Wikipedia; PROD_ID: RES-10327
R7 = SparkFun-Resistors:30.1KOHM: 30.1kΩ resistor A resistor is a passive two-terminal electrical component that implements electrical resistance as a circuit element. Resistors act to reduce current flow, and, at the same time, act to lower voltage levels within circuits. - Wikipedia; PROD_ID: RES-14690
R8 R26 = SparkFun-Resistors:100KOHM: 100kΩ resistor A resistor is a passive two-terminal electrical component that implements electrical resistance as a circuit element. Resistors act to reduce current flow, and, at the same time, act to lower voltage levels within circuits. - Wikipedia; PROD_ID: RES-07828
R9 = SparkFun-Resistors:0.015OHM: 0.015Ω resistor (aka 15mOhms) A resistor is a passive two-terminal electrical component that implements electrical resistance as a circuit element. Resistors act to reduce current flow, and, at the same time, act to lower voltage levels within circuits. - Wikipedia; PROD_ID: RES-16305
R10 R11 = SparkFun-Resistors:100OHM: 100Ω resistor A resistor is a passive two-terminal electrical component that implements electrical resistance as a circuit element. Resistors act to reduce current flow, and, at the same time, act to lower voltage levels within circuits. - Wikipedia; PROD_ID: RES-14962
R13 R28 = SparkFun-Resistors:2.0KOHM: 2kΩ resistor A resistor is a passive two-terminal electrical component that implements electrical resistance as a circuit element. Resistors act to reduce current flow, and, at the same time, act to lower voltage levels within circuits. - Wikipedia; PROD_ID: RES-15406
R15 = SparkFun-Resistors:3.3KOHM: 3.3kΩ resistor A resistor is a passive two-terminal electrical component that implements electrical resistance as a circuit element. Resistors act to reduce current flow, and, at the same time, act to lower voltage levels within circuits. - Wikipedia; PROD_ID: RES-15923
R24 = SparkFun-Resistors:20KOHM: 20kΩ resistor A resistor is a passive two-terminal electrical component that implements electrical resistance as a circuit element. Resistors act to reduce current flow, and, at the same time, act to lower voltage levels within circuits. - Wikipedia; PROD_ID: RES-09383
R27 = SparkFun-Resistors:220KOHM: 220kΩ resistor A resistor is a passive two-terminal electrical component that implements electrical resistance as a circuit element. Resistors act to reduce current flow, and, at the same time, act to lower voltage levels within circuits. - Wikipedia; PROD_ID: RES-08969
R31 = SparkFun-Resistors:20KOHM: 20kΩ resistor A resistor is a passive two-terminal electrical component that implements electrical resistance as a circuit element. Resistors act to reduce current flow, and, at the same time, act to lower voltage levels within circuits. - Wikipedia; PROD_ID: RES-14972
S1 = SparkFun-Switches:MOMENTARY-SWITCH-SPST-2: Momentary Switch (Pushbutton) - SPST - Two Circuits Normally-open (NO) SPST momentary switches (buttons, pushbuttons). Schematic symbol includes two switch circuits. Variants SMD-4.6MMX2.8MM - 4.60mm x 2.80mm Tactile Momentary Button Switch - Used on SparkFun Pro Micro - RP2040 <https://www.sparkfun.com/products/17717> SMD-5.2MM - Mini Pushbutton Switch - SMD <https://www.sparkfun.com/products/8720> - Used on Arduino Pro Mini <https://www.sparkfun.com/products/11114>; PROD_ID: SWCH-14139
SPI = SparkFun-Connectors:CONN_07: Multi connection point. Often used as Generic Header-pin footprint for 0.1 inch spaced/style header connections On any of the 0.1 inch spaced packages, you can populate with these: Break Away Headers - Straight <https://www.sparkfun.com/products/116> (PRT-00116) Break Away Male Headers - Right Angle <https://www.sparkfun.com/products/553> (PRT-00553) Female Headers <https://www.sparkfun.com/products/115> (PRT-00115) Break Away Headers - Machine Pin <https://www.sparkfun.com/products/117> (PRT-00117) Break Away Female Headers - Swiss Machine Pin <https://www.sparkfun.com/products/743> (PRT-00743) For SCREWTERMINALS and SPRING TERMINALS visit here: Screw Terimnals on SparkFun.com <https://www.sparkfun.com/search/results?term=Screw+Terminals> (5mm/3.5mm/2.54mm spacing) This device is also useful as a general connection point to wire up your design to another part of your project. Our various solder wires solder well into these plated through hole pads. Hook-Up Wire - Assortment (Stranded, 22 AWG) <https://www.sparkfun.com/products/11375> (PRT-11375) Hook-Up Wire - Assortment (Solid Core, 22 AWG) <https://www.sparkfun.com/products/11367> (PRT-11367) View the entire wire category on our website here <https://www.sparkfun.com/categories/141> Special notes: Molex polarized connector foot print use with SKU : PRT-08231 with associated crimp pins and housings. 1MM SMD Version SKU: PRT-10208 NOTES ON THE VARIANTS LOCK and LOCK_LONGPADS... This footprint was designed to help hold the alignment of a through-hole component (i.e. 6-pin header) while soldering it into place. You may notice that each hole has been shifted either up or down by 0.005 of an inch from it's more standard position (which is a perfectly straight line). This slight alteration caused the pins (the squares in the middle) to touch the edges of the holes. Because they are alternating, it causes a "brace" to hold the component in place. 0.005 has proven to be the perfect amount of "off-center" position when using our standard breakaway headers. Although looks a little odd when you look at the bare footprint, once you have a header in there, the alteration is very hard to notice. Also,if you push a header all the way into place, it is covered up entirely on the bottom side.
U1 = SparkFun-IC-Comms:CH340E; PROD_ID: IC-14135
U2 = SparkFun-IC-Power:LTC3225EDDB: 150mA Supercapacitor Charger; PROD_ID: IC-14693
U3 = SparkFun-IC-Power:ADM4210_1: Hot Swap Controller (In-Rush Current Limiter); PROD_ID: IC-14694
U4 = SparkFun-GPS:U-BLOX_ZOE_M8Q-0-10: UBLOX ZOE-M8Q-0-10 u-blox ZOE-M8 standard precision GNSS SiP (System in Package) modules feature the high performance u-blox M8 GNSS engine. ZOE-M8’s ultra-miniature form factor integrates a complete GNSS receiver including SAW filter, LNA and TCXO. Handles all GNSS systems and can simulatenously use up to three of them, with accuracy ranging from 2.5m to 4m. GPS GLONASS BeiDou Galileo This can be corrected with the SBAS or QZSS augmentation systems.; PROD_ID: IC-14251
U5 = SparkFun-RF:AS179-92LF: SKYWORKS SOLUTIONS - AS179-92LF - IC, SWITCH, RF, SPDT, 0.02-3.0GHZ Source: Datasheet <http://www.skyworksinc.com/uploads/documents/AS179_92LF_200176H.pdf>; PROD_ID: IC-15047
U6 = SparkFun-Sensors:MS8607-02BA01: PHT Combination Sensor Source: Datasheet <http://www.te.com/commerce/DocumentDelivery/DDEController?Action=showdoc&DocId=Data SheetMS8607-02BA01BpdfEnglishENG_DS_MS8607-02BA01_B.pdfCAT-BLPS0018>; PROD_ID: IC-15048
U7 = SparkFun-IC-Microcontroller:ARTEMIS_MODULE: Description: The Artemis Module from SparkFun is a Cortex-M4F with BLE 5.0 running up to 96MHz and with as low power as 6uA per MHz (less than 5mW). This is the world's first module to bridge the market between hobbyists and consumer products. We've packaged all the power of a modern microcontroller into a module that is both extremely easy to use but is mass-market ready. The flexibility of the Artemis module starts with our [Arduino core](https://github.com/sparkfun/Arduino_Apollo3). You can program and use the Artemis module just like you would an Uno or any other Arduino. Time to first blink is just 5 minutes away! We built the core from the ground up, making it fast and as light weight as possible.; PROD_ID: SUB-14402
U8 = SparkFun-IC-Power:V_SUPERVISOR: BD48xxx - Voltage Detector IC ROHM’s BD48xxx and BD49xxx series are highly accurate, low-current Voltage Detector IC series. The family includes BD48xxx devices with N-channel open drain output and BD49xxx devices with CMOS output. The devices are available for specific detection voltages ranging from 2.3V to 6.0V in increments of 0.1V.; PROD_ID: IC-15065; VOLTAGE: 2.4
U9 = SparkFun-IC-Power:MCP73831: MCP73831T Li-Ion, Li-Pol Controller Miniature single cell, fully integrated Li-Ion, Li-polymer charge management controller Datasheet <http://ww1.microchip.com/downloads/en/DeviceDoc/20001984g.pdf> SparkFun Products: SparkFun ESP32 Thing <https://www.sparkfun.com/products/13907> SparkFun 9DoF Razor IMU M0 <https://www.sparkfun.com/products/14001>; PROD_ID: IC-09995
U10 = SparkFun-IC-Power:V_REG_AP2112: AP2112 - 600mA CMOS LDO Regulator w/ Enable The AP2112 is CMOS process low dropout linear regulator with enable function, the regulator delivers a guaranteed 600mA (min.) continuous load current. Features Output Voltage Accuracy: ±1.5% Output Current: 600mA (Min.) Foldback Short Current Protection: 50mA Enable Function to Turn ON/OFF VOUT Low Dropout Voltage (3.3V): 250mV (Typ.) @IOUT=600mA Excellent Load Regulation: 0.2%/A (Typ.) Excellent Line Regulation: 0.02%/V (Typ.) Low Quiescent Current: 55μA (Typ.) Low Standby Current: 0.01μA (Typ.) Low Output Noise: 50μVRMS PSRR: 100Hz -65dB, 1kHz -65dB OTSD Protection Stable with 1.0μF Flexible Cap: Ceramic, Tantalum and Aluminum Electrolytic Operation Temperature Range: -40°C to 85°C ESD: MM 400V, HBM 4000V; PROD_ID: VREG-12457
U11 = SparkFun-IC-Logic:74*1G04: Single Inverter IC NOT GATE INVERTER SNGL 1IN SOT353 Supply: 1.65V to 5.5V Datasheet <http://diodes.com/datasheets/74LVC1G04.pdf> SparkFun Products SparkFun Stepoko <https://www.sparkfun.com/products/13899> (ROB-13899) SparkFun CryptoShield <https://www.sparkfun.com/products/13183> (DEV-13183) SparkFun LogicBlocks Kit <https://www.sparkfun.com/products/11006> (KIT-11006) SparkFun ArduMoto <https://www.sparkfun.com/products/9815> (DEV-09815); PROD_ID: IC-10843
U12 = SparkFun-IC-Logic:74*08: Single AND gate IC GATE AND SNGL 2INPUT (Comes in both SOT353 and SOT23-5) SparkFun Products SparkFun LogicBlocks Kit <https://www.sparkfun.com/products/11006> (KIT-11006) SparkFun RedBot Mainboard <https://www.sparkfun.com/products/12097> (ROB-12097); PROD_ID: IC-16359
X1 X2 = SparkFun-Clocks:CRYSTAL-32.768KHZ: 32.768kHz Crystal Frequency: 32.768kHz Frequency Stability: ±20ppm Load Capacitance: 12.5pF (PTH-2X6 & SMD-3.2X1.5), 6pF (SMD-2X6) SparkFun Products: SparkFun BigTime Watch Kit <https://www.sparkfun.com/products/11734> SparkFun nRF52832 Breakout <https://www.sparkfun.com/products/13990> SparkFun Real Time Clock Module <https://www.sparkfun.com/products/12708>; PROD_ID: XTAL-13062

## Net classes
1 3.3V: width 0.203 mm